# EAGLE schematic Ver_Full (EAGLE 9.6.2)
Contributed by Nordic Semiconductor Product Page here <http://infocenter.nordicsemi.com/index.jsp?topic=%2Fcom.nordic.infocenter.nrf52832.ps.v1.1%2Fref_circuitry.html> Disclaimer: For the most up to date reference layout see the infocenter at nordicsemi.com Description: Bluetooth Low Energy board

## Sheet 1 of 2
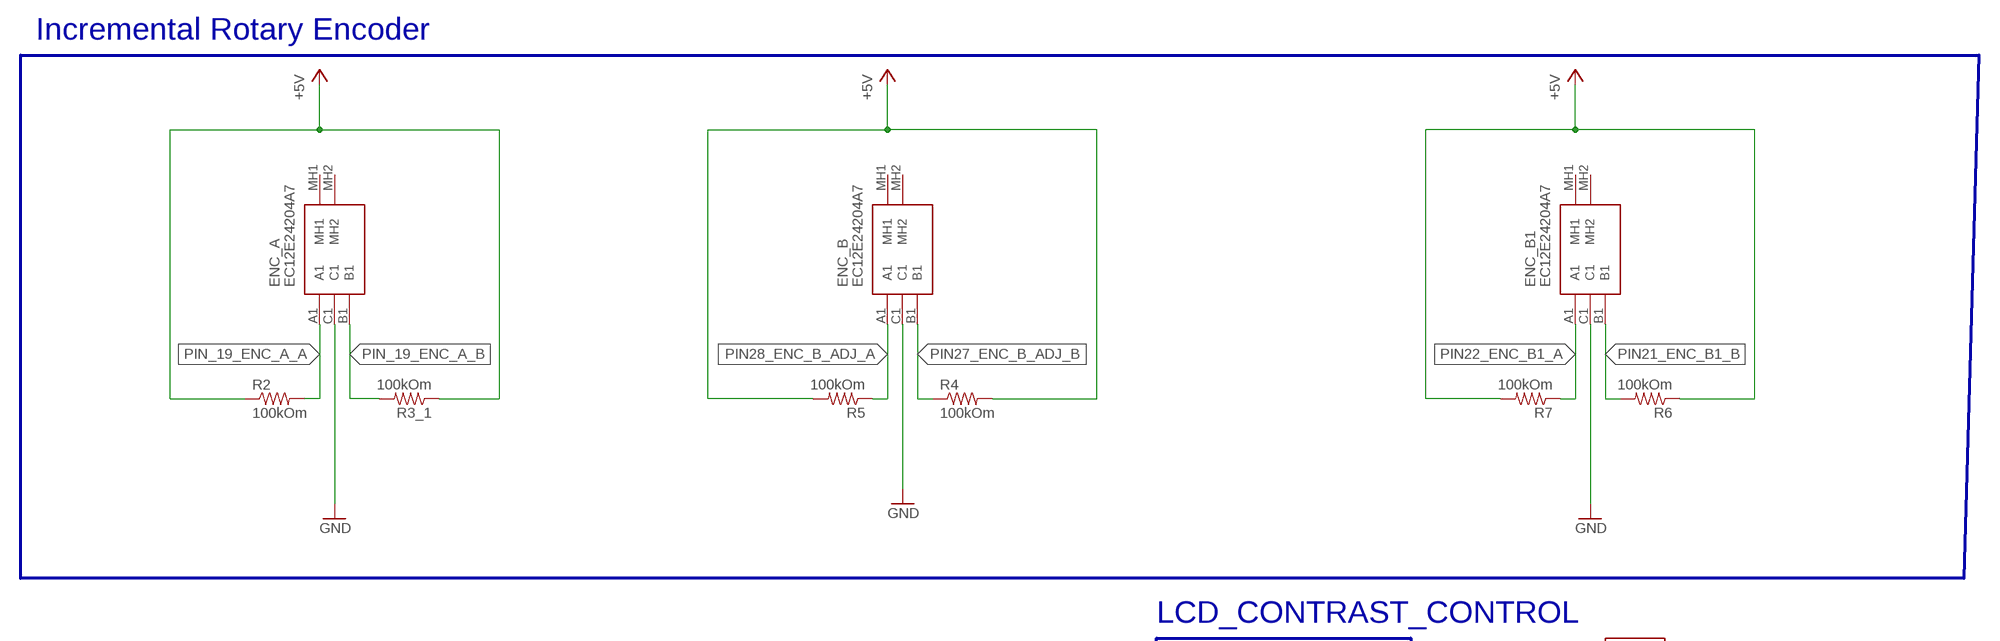
[diagram p0: schematic, sheet 1, part 1 of 3]
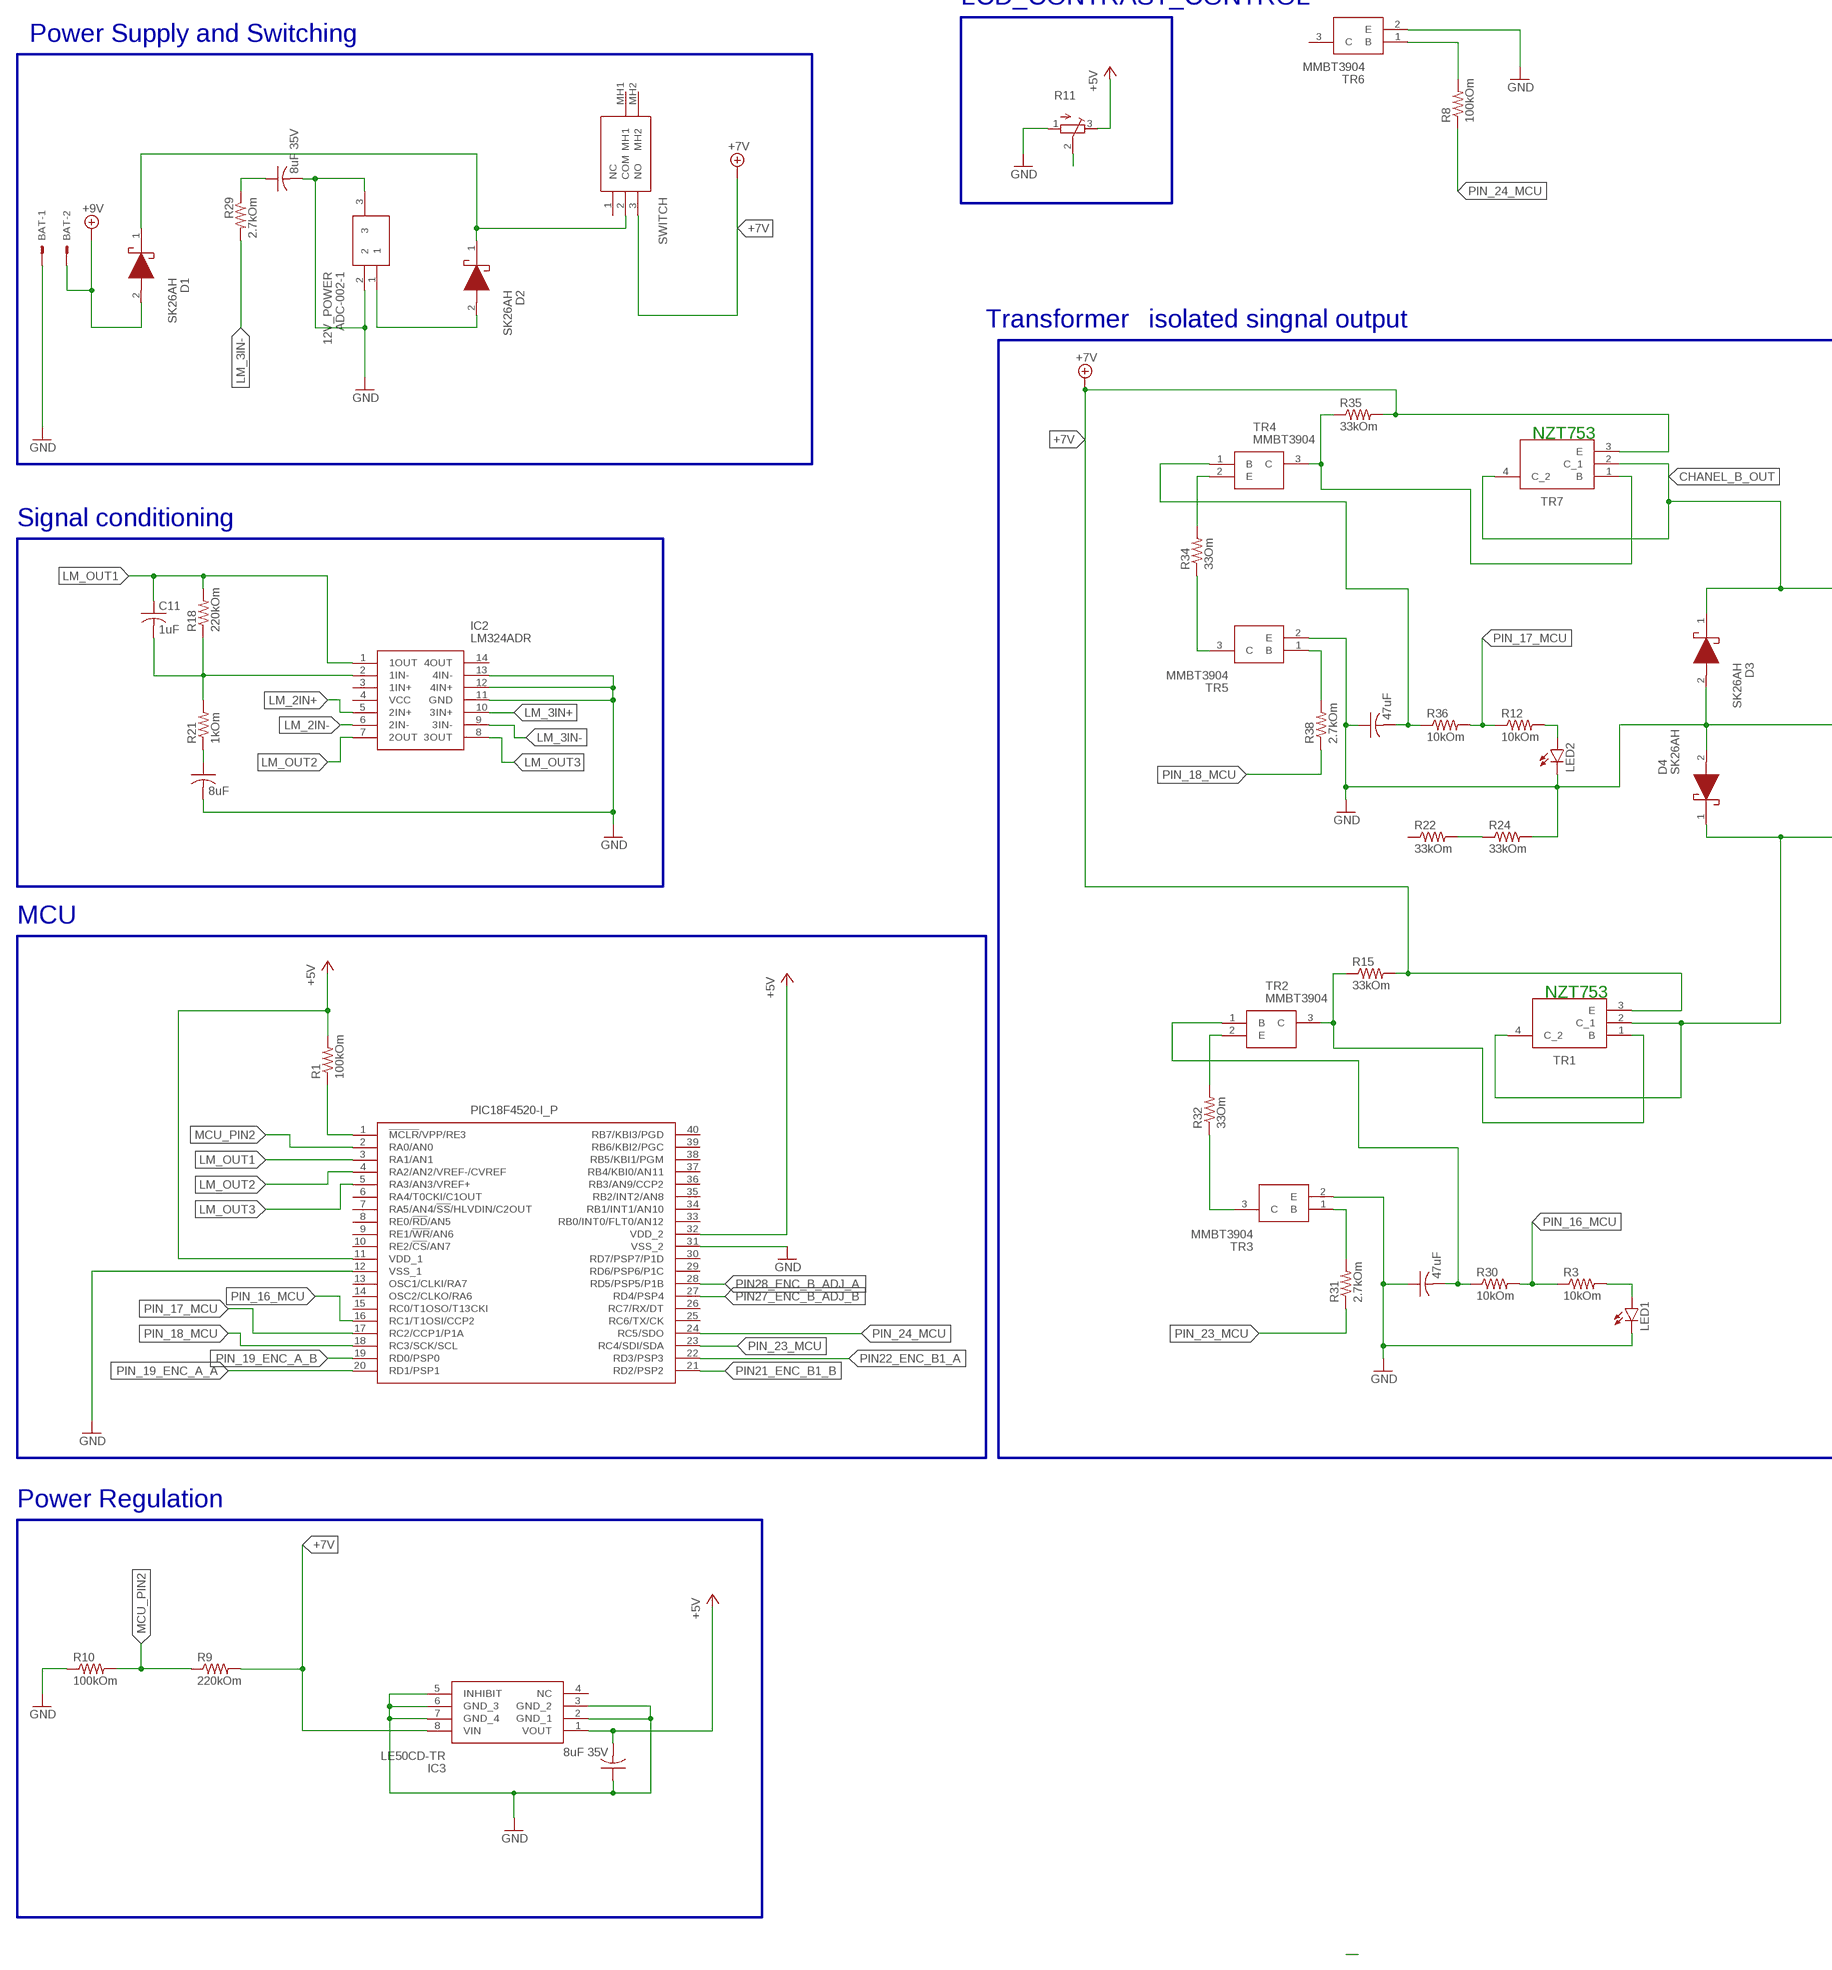
[diagram p1: schematic, sheet 1, part 2 of 3]
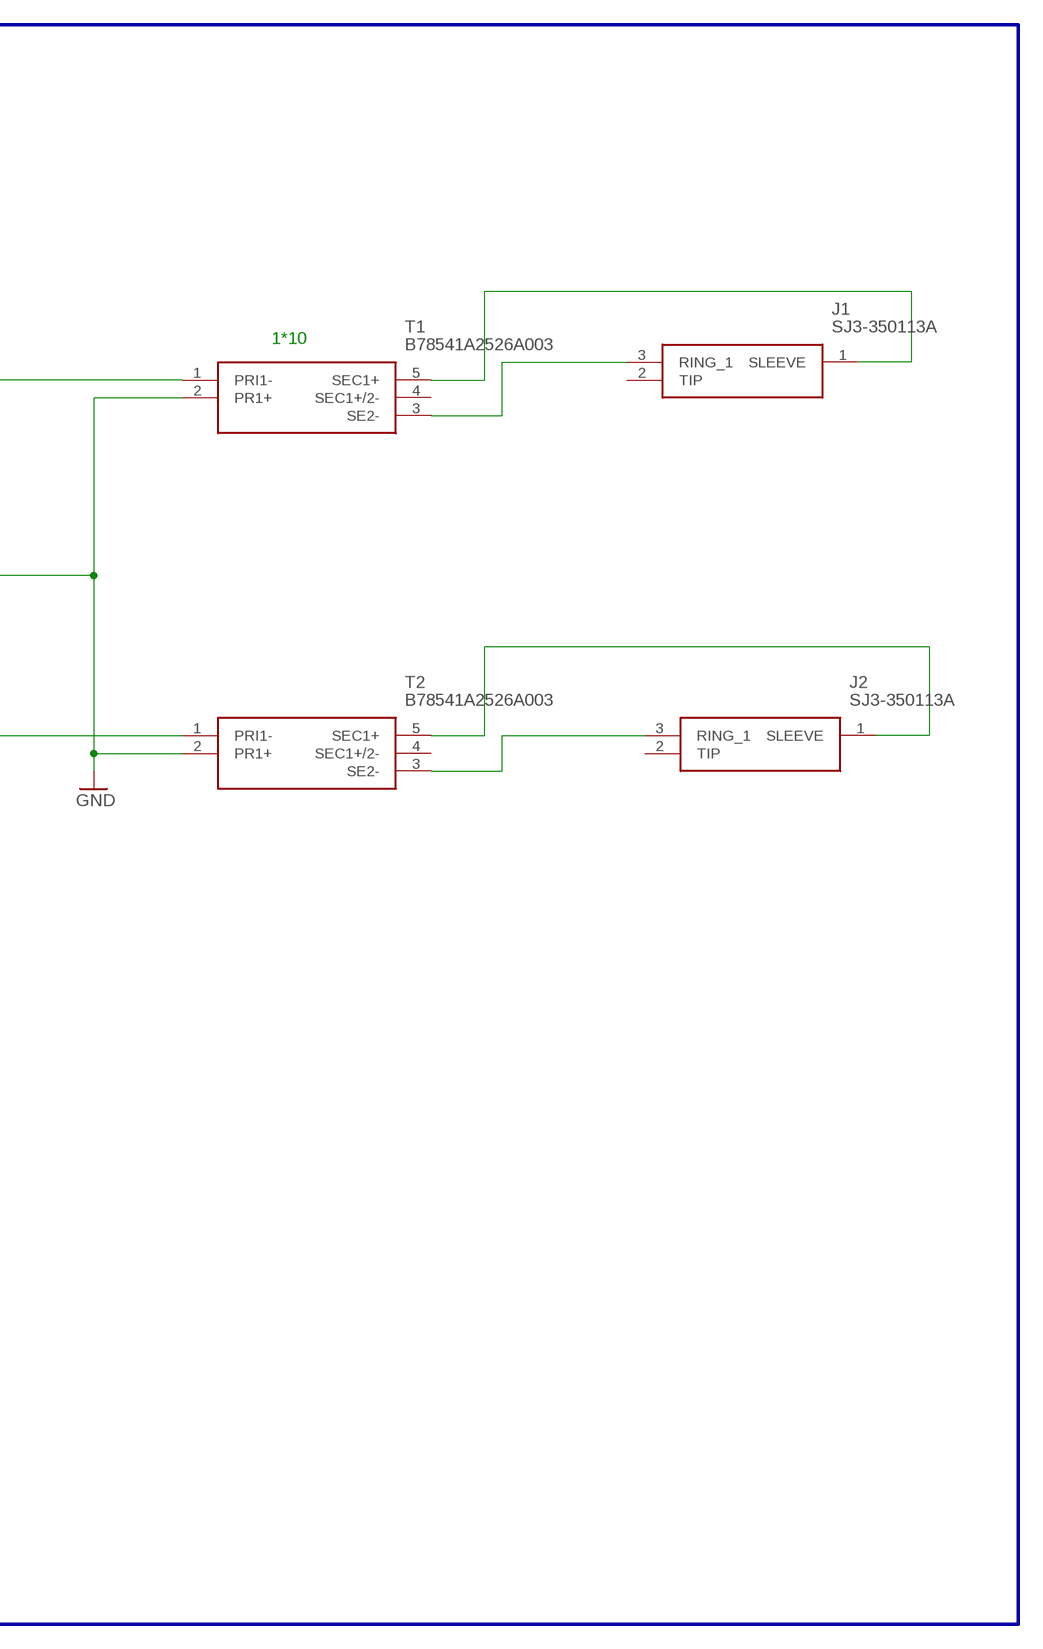
[diagram p2: schematic, sheet 1, part 3 of 3]

### Parts
12V_POWER  ADC-002-1  [ADC0021]
BAT  22-23-2021  [22-23-2021]
C2  8uF 35V  C-USC1608  [C1608]
C3_1  8uF 35V  C-USC1608  [C1608]
C6  8uF  C-USC1608  [C1608]
C11  1uF  C-USC0603  [C0603]
C14  47uF  C-USC1608  [C1608]
C16  47uF  C-USC1608  [C1608]
D1  SK26AH  [DIONM5126X250N]
D2  SK26AH  [DIONM5126X250N]
D3  SK26AH  [DIONM5126X250N]
D4  SK26AH  [DIONM5126X250N]
ENC_A  EC12E24204A7  [EC12E24204A7]
ENC_B  EC12E24204A7  [EC12E24204A7]
ENC_B1  EC12E24204A7  [EC12E24204A7]
IC1  PIC18F4520-I_P  [DIP1778W58P254L5175H635Q40N]
IC2  LM324ADR  [SOIC127P600X175-14N]
IC3  LE50CD-TR  [SOIC127P600X175-8N]
J1  SJ3-350113A  [SJ3350113A]
J2  SJ3-350113A  [SJ3350113A]
LED1  LAP4-BOTTOM  [P47F-BOTTOM]
LED2  LAP4-BOTTOM  [P47F-BOTTOM]
R1  100kOm  R-US_R0402  [R0402]
R2  100kOm  R-US_R0402  [R0402]
R3  10kOm  R-US_R0402  [R0402]
R3_1  100kOm  R-US_R0402  [R0402]
R4  100kOm  R-US_R0402  [R0402]
R5  100kOm  R-US_R0402  [R0402]
R6  100kOm  R-US_R0402  [R0402]
R7  100kOm  R-US_R0402  [R0402]
R8  100kOm  R-US_R0402  [R0402]
R9  220kOm  R-US_R0402  [R0402]
R10  100kOm  R-US_R0402  [R0402]
R11  R-TRIMM4G/J  [RTRIM4G/J]
R12  10kOm  R-US_R0402  [R0402]
R15  33kOm  R-US_R0402  [R0402]
R18  220kOm  R-US_R0402  [R0402]
R21  1kOm  R-US_R0402  [R0402]
R22  33kOm  R-US_R0402  [R0402]
R24  33kOm  R-US_R0402  [R0402]
R29  2.7kOm  R-US_R0402  [R0402]
R30  10kOm  R-US_R0402  [R0402]
R31  2.7kOm  R-US_R0402  [R0402]
R32  33Om  R-US_R0402  [R0402]
R34  33Om  R-US_R0402  [R0402]
R35  33kOm  R-US_R0402  [R0402]
R36  10kOm  R-US_R0402  [R0402]
R38  2.7kOm  R-US_R0402  [R0402]
S1  SWITCH  5MS1S102AM6QES  [5MS1S102AM6QES]
T1  B78541A2526A003  [B78541A2526A003]
T2  B78541A2526A003  [B78541A2526A003]
TR1  NSS60600MZ4T1G  [SOT230P700X175-4N]
TR2  MMBT3904  [SOT95P240X120-3N]
TR3  MMBT3904  [SOT95P240X120-3N]
TR4  MMBT3904  [SOT95P240X120-3N]
TR5  MMBT3904  [SOT95P240X120-3N]
TR6  MMBT3904  [SOT95P240X120-3N]
TR7  NSS60600MZ4T1G  [SOT230P700X175-4N]

### Nets
12V: 12V_POWER.1 D2.2(A)
+5V: C3_1.2 IC1.11(VDD_1) IC1.32(VDD_2) IC3.1(VOUT) R1.2 R2.1 R3_1.1 R4.2 R5.2 R6.1 R7.2 R11.3(E)
+7V: IC3.8(VIN) R9.2 R15.2 R35.2 S1.3(NO) TR1.3(E) TR7.3(E)
+9V: BAT.2 D1.2(A)
CHANEL_B_OUT: D3.1(K) T1.1(PRI1-) TR7.2(C_1) TR7.4(C_2)
GND: 12V_POWER.2 12V_POWER.3 BAT.1 C2.2 C3_1.1 C6.2 C14.1 C16.1 D3.2(A) D4.2(A) ENC_A.C1 ENC_B1.C1 ENC_B.C1 IC1.12(VSS_1) IC1.31(VSS_2) IC2.11(GND) IC2.12(4IN+) IC2.13(4IN-) IC3.2(GND_1) IC3.3(GND_2) IC3.5(INHIBIT) IC3.6(GND_3) IC3.7(GND_4) LED1.C LED2.C R10.1 R11.1(A) R24.2 T1.2(PR1+) T2.2(PR1+) TR3.2(E) TR5.2(E) TR6.2(E)
LM_2IN+: IC2.5(2IN+)
LM_2IN-: IC2.6(2IN-)
LM_3IN+: IC2.10(3IN+)
LM_3IN-: IC2.9(3IN-) R29.2
LM_OUT1: C11.1 IC1.3(RA1/AN1) IC2.1(1OUT) R18.2
LM_OUT2: IC1.4(RA2/AN2/VREF-/CVREF) IC2.7(2OUT)
LM_OUT3: IC1.5(RA3/AN3/VREF+) IC2.8(3OUT)
MCU_PIN2: IC1.2(RA0/AN0) R9.1 R10.2
N$1: IC1.1(!MCLR!/VPP/RE3) R1.1
N$2: C11.2 IC2.2(1IN-) R18.1 R21.2
N$4: C16.2 R36.1 TR4.1(B)
N$5: R34.2 TR4.2(E)
N$6: R38.2 TR5.1(B)
N$7: R34.1 TR5.3(C)
N$8: R35.1 TR4.3(C) TR7.1(B)
N$11: D1.1(K) D2.1(K) S1.2(COM)
N$12: C2.1 R29.1
N$13: C6.1 R21.1
N$14: J1.1(SLEEVE) T1.5(SEC1+)
N$15: C14.2 R30.1 TR2.1(B)
N$16: R32.2 TR2.2(E)
N$17: R32.1 TR3.3(C)
N$18: R31.2 TR3.1(B)
N$19: R15.1 TR1.1(B) TR2.3(C)
N$21: D4.1(K) T2.1(PRI1-) TR1.2(C_1) TR1.4(C_2)
N$22: J1.3(RING_1) T1.3(SE2-)
N$23: LED2.A R12.2
N$24: J2.3(RING_1) T2.3(SE2-)
N$25: LED1.A R3.2
N$26: J2.1(SLEEVE) T2.5(SEC1+)
N$27: R22.2 R24.1
N$28: R8.2 TR6.1(B)
N$29: R11.2(S)
PIN21_ENC_B1_B: ENC_B1.B1 IC1.21(RD2/PSP2) R6.2
PIN22_ENC_B1_A: ENC_B1.A1 IC1.22(RD3/PSP3) R7.1
PIN27_ENC_B_ADJ_B: ENC_B.B1 IC1.27(RD4/PSP4) R4.1
PIN28_ENC_B_ADJ_A: ENC_B.A1 IC1.28(RD5/PSP5/P1B) R5.1
PIN_16_MCU: IC1.16(RC1/T1OSI/CCP2) R3.1 R30.2
PIN_17_MCU: IC1.17(RC2/CCP1/P1A) R12.1 R36.2
PIN_18_MCU: IC1.18(RC3/SCK/SCL) R38.1
PIN_19_ENC_A_A: ENC_A.A1 IC1.20(RD1/PSP1) R2.2
PIN_19_ENC_A_B: ENC_A.B1 IC1.19(RD0/PSP0) R3_1.2
PIN_23_MCU: IC1.23(RC4/SDI/SDA) R31.1
PIN_24_MCU: IC1.24(RC5/SDO) R8.1
Unconnected: ENC_A.MH1 ENC_A.MH2 ENC_B1.MH1 ENC_B1.MH2 ENC_B.MH1 ENC_B.MH2 IC1.6(RA4/T0CKI/C1OUT) IC1.7(RA5/AN4/!SS!/HLVDIN/C2OUT) IC1.8(RE0/!RD!/AN5) IC1.9(RE1/!WR!/AN6) IC1.10(RE2/!CS!/AN7) IC1.13(OSC1/CLKI/RA7) IC1.14(OSC2/CLKO/RA6) IC1.15(RC0/T1OSO/T13CKI) IC1.25(RC6/TX/CK) IC1.26(RC7/RX/DT) IC1.29(RD6/PSP6/P1C) IC1.30(RD7/PSP7/P1D) IC1.33(RB0/INT0/FLT0/AN12) IC1.34(RB1/INT1/AN10) IC1.35(RB2/INT2/AN8) IC1.36(RB3/AN9/CCP2) IC1.37(RB4/KBI0/AN11) IC1.38(RB5/KBI1/PGM) IC1.39(RB6/KBI2/PGC) IC1.40(RB7/KBI3/PGD) IC2.3(1IN+) IC2.4(VCC) IC2.14(4OUT) IC3.4(NC) J1.2(TIP) J2.2(TIP) R22.1 S1.1(NC) S1.MH1 S1.MH2 T1.4(SEC1+/2-) T2.4(SEC1+/2-) TR6.3(C)

### Buses
B$1
B$2
B$3
B$4
B$5
B$6
B$7

### Notes on the sheet
- Incremental Rotary Encoder
- LCD_CONTRAST_CONTROL
- Power Supply and Switching
- Transformer‑isolated singnal output
- NZT753
- Signal conditioning
- 1*10
- MCU
- NZT753
- Power Regulation

## Sheet 2 of 2
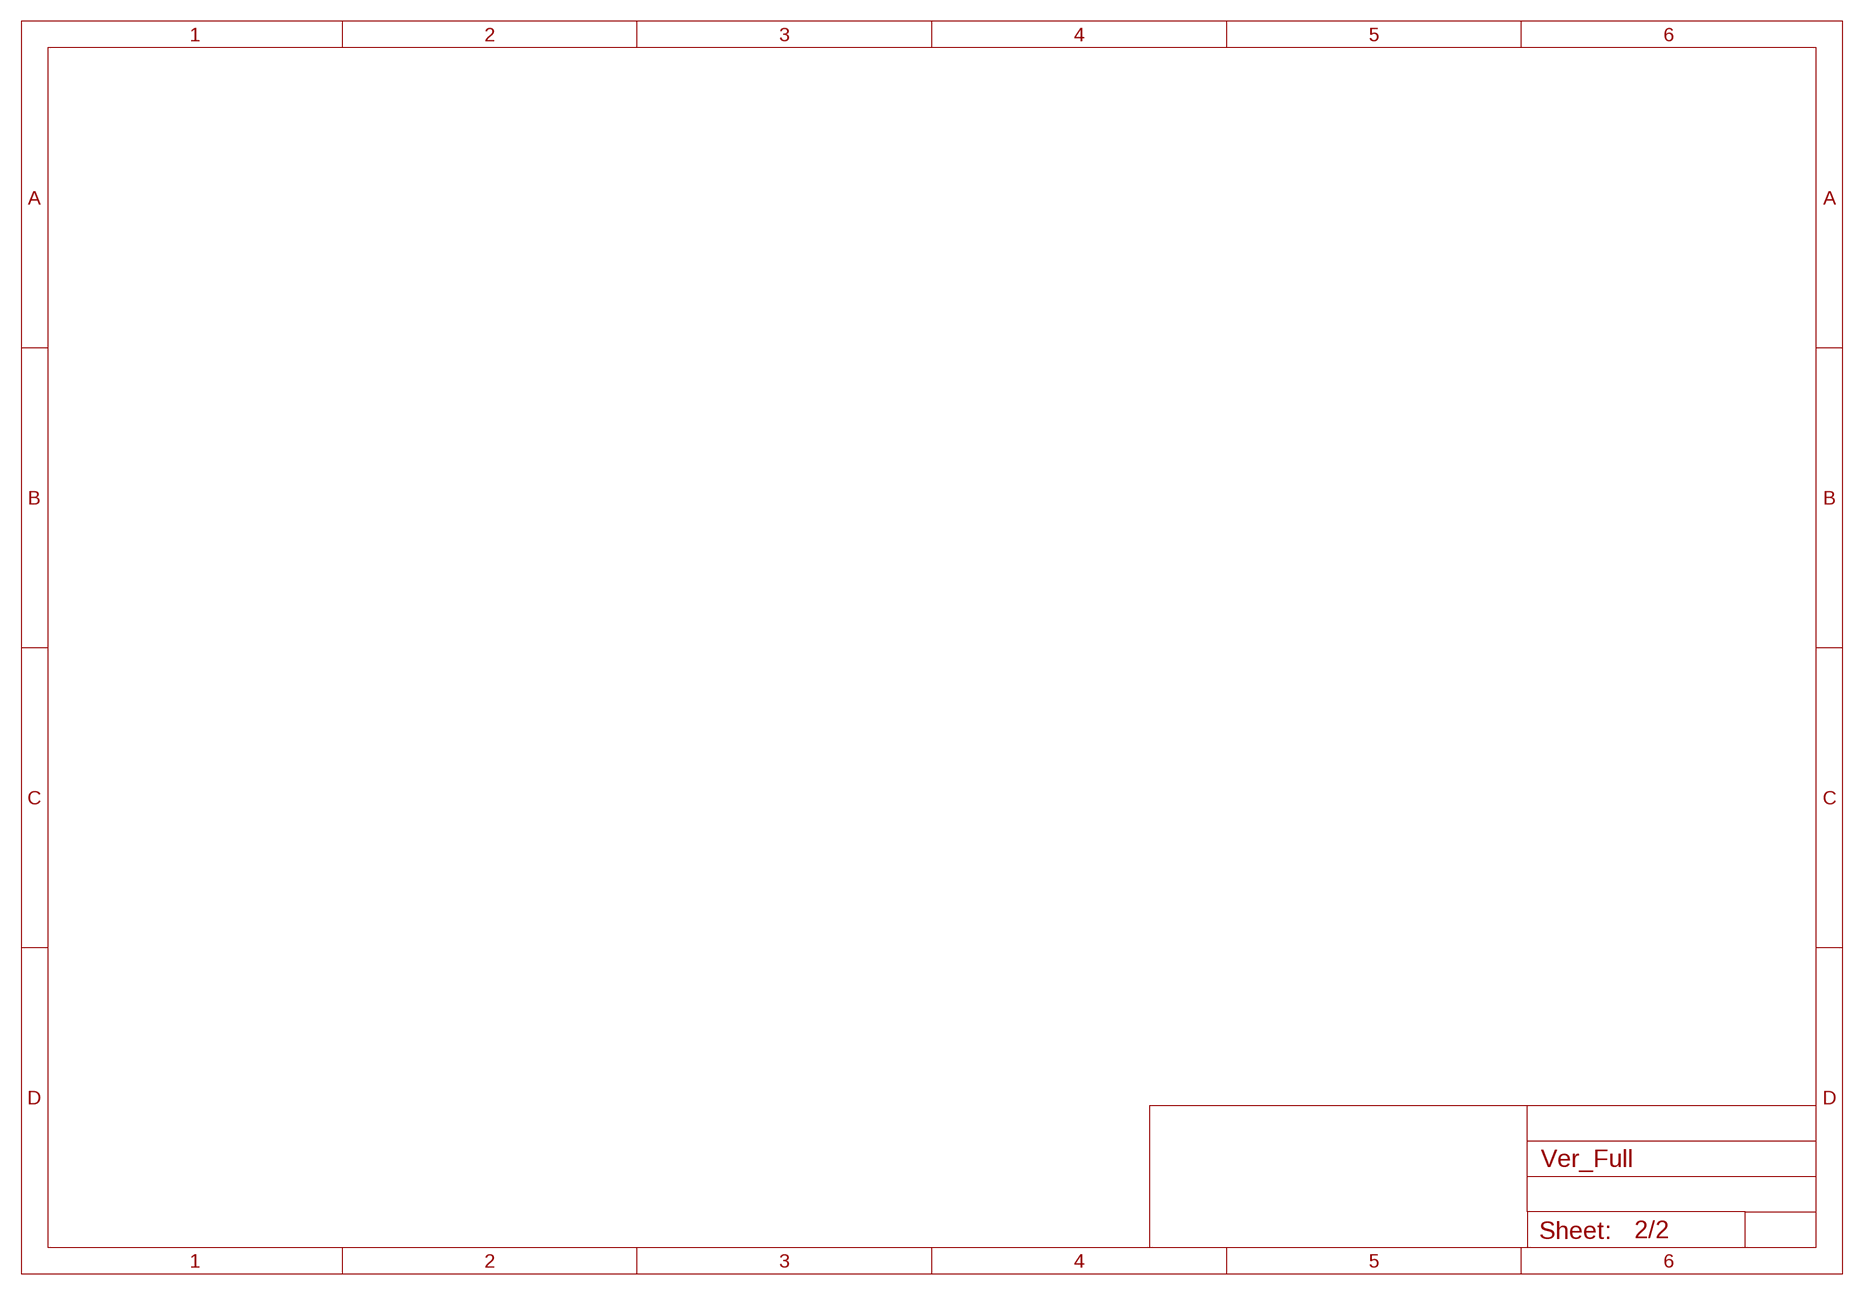
[diagram p3: schematic, sheet 2]

## Library data of the parts
12V_POWER = SamacSys_Parts:ADC-002-1: Power Barrel Connector Jack Through Hole, Right Angle Source: Datasheet <https://www.digikey.ph/en/products/detail/adam-tech/ADC-002-1/21710741?msockid=39f1ec84d77b6f4428b7f904d6676eed>; DESCRIPTION: Power Barrel Connector Jack Through Hole, Right Angle; HEIGHT: 11.3792mm; MANUFACTURER_NAME: Adam Tech; MANUFACTURER_PART_NUMBER: ADC-002-1; MOUSER_PART_NUMBER: 737-ADC-002-1; MOUSER_PRICE-STOCK: https://www.mouser.co.uk/ProductDetail/Adam-Tech/ADC-002-1?qs=TTVbHWoAP%2FQzK0nl%252BlYw5w%3D%3D
BAT = con-molex:22-23-2021: .100" (2.54mm) Center Header - 2 Pin; MF: MOLEX; MPN: 22-23-2021; OC_FARNELL: 1462926; OC_NEWARK: 25C3832
C2 C3_1 C6 C11 C14 C16 = rcl:C-US: CAPACITOR, American symbol; SPICEPREFIX: C
D1-D4 = SamacSys_Parts:SK26AH: Schottky Diodes & Rectifiers 2A, 60V, Schottky Rectifier Source: Datasheet <https://services.taiwansemi.com/storage/resources/datasheet/SK22AH SERIES_C2307.pdf>; DESCRIPTION: Schottky Diodes & Rectifiers 2A, 60V, Schottky Rectifier; HEIGHT: 2.5mm; MANUFACTURER_NAME: Taiwan Semiconductor; MANUFACTURER_PART_NUMBER: SK26AH; MOUSER_PART_NUMBER: 821-SK26AH; MOUSER_PRICE-STOCK: https://www.mouser.co.uk/ProductDetail/Taiwan-Semiconductor/SK26AH?qs=lc2O%252BfHJPVZtnjroFweAcw%3D%3D
ENC_A ENC_B ENC_B1 = SamacSys_Parts:EC12E24204A7: Encoders 5 Volts Through Hole Source: Datasheet; DESCRIPTION: Encoders 5 Volts Through Hole; HEIGHT: 17.5mm; MANUFACTURER_NAME: ALPS Electric; MANUFACTURER_PART_NUMBER: EC12E24204A7; MOUSER_PART_NUMBER: 688-EC12E24204A7; MOUSER_PRICE-STOCK: https://www.mouser.co.uk/ProductDetail/Alps-Alpine/EC12E24204A7?qs=6EGMNY9ZYDRQC31O9PLGdQ%3D%3D
IC1 = SamacSys_Parts:PIC18F4520-I_P: Micro,PIC,32K Fl,DIP40,PIC18F4520-I/P Microchip PIC18F4520-I/P, 8bit PIC Microcontroller, 40MHz, 32 kB, 256 B Flash, 40-Pin PDIP Source: Datasheet <https://datasheet.datasheetarchive.com/originals/distributors/Datasheets-DGA25/1725603.pdf>; DESCRIPTION: Micro,PIC,32K Fl,DIP40,PIC18F4520-I/P Microchip PIC18F4520-I/P, 8bit PIC Microcontroller, 40MHz, 32 kB, 256 B Flash, 40-Pin PDIP; HEIGHT: 6.35mm; MANUFACTURER_NAME: Microchip; MANUFACTURER_PART_NUMBER: PIC18F4520-I/P; MOUSER_PART_NUMBER: 579-PIC18F4520-I/P; MOUSER_PRICE-STOCK: https://www.mouser.co.uk/ProductDetail/Microchip-Technology/PIC18F4520-I-P?qs=sX%2FisSQq3c766Z6wYlOmBg%3D%3D
IC2 = SamacSys_Parts:LM324ADR: LM324ADR, Quad Operational Amplifier 1.2MHz 5 to 28V, 14-Pin SOIC Source: Datasheet <http://www.ti.com/lit/ds/symlink/lm324a.pdf>; DESCRIPTION: LM324ADR, Quad Operational Amplifier 1.2MHz 5 to 28V, 14-Pin SOIC; HEIGHT: 1.75mm; MANUFACTURER_NAME: Texas Instruments; MANUFACTURER_PART_NUMBER: LM324ADR; MOUSER_PART_NUMBER: 595-LM324ADR; MOUSER_PRICE-STOCK: https://www.mouser.co.uk/ProductDetail/Texas-Instruments/LM324ADR?qs=j01uVdFEFjGTgJsnyinRPw%3D%3D
IC3 = SamacSys_Parts:LE50CD-TR: LE50CD-TR, Low Dropout Voltage Regulator, 0.1A, 5 V +/-2%, 8-Pin SO Source: Datasheet <http://www.st.com/st-web-ui/static/active/en/resource/technical/document/datasheet/CD00000545.pdf>; DESCRIPTION: LE50CD-TR, Low Dropout Voltage Regulator, 0.1A, 5 V +/-2%, 8-Pin SO; HEIGHT: 1.75mm; MANUFACTURER_NAME: STMicroelectronics; MANUFACTURER_PART_NUMBER: LE50CD-TR; MOUSER_PART_NUMBER: 511-LE50CD-TR; MOUSER_PRICE-STOCK: https://www.mouser.co.uk/ProductDetail/STMicroelectronics/LE50CD-TR?qs=03sMZZnzz33VVYaNvjw4jw%3D%3D
J1 J2 = SamacSys_Parts:SJ3-350113A: 3.50mm (0.141", 1/8", Mini Plug) - Headphone Phone Jack Stereo (3 Conductor, TRS) Connector Solder Source: Datasheet <https://www.sameskydevices.com/product/resource/sj3-35011x.pdf>; DESCRIPTION: 3.50mm (0.141", 1/8", Mini Plug) - Headphone Phone Jack Stereo (3 Conductor, TRS) Connector Solder; HEIGHT: 5.8mm; MANUFACTURER_NAME: Same Sky; MANUFACTURER_PART_NUMBER: SJ3-350113A
LED1 LED2 = led:*P4: PointLED® Enhanced Thinfilm LED TOP & BOTTOM mount LS P47F, LR P47F, LA P47F, LY P47F, LT P4SG, LB P4SG, LW P4SG Source: http://catalog.osram-os.com .. LA_LR_LS_LY_P47F_Pb_free.pdf
R1-R3 R3_1 R4-R10 R12 R15 R18 R21 R22 R24 R29-R32 R34-R36 R38 = rcl:R-US_: RESISTOR, American symbol; SPICEPREFIX: R
R11 = rcl:R-TRIMM: Trimm resistor; SPICEMODEL: X; SPICEPREFIXL: POT
S1 = SamacSys_Parts:5MS1S102AM6QES: Slide Switches ON-ON SPDT Right Source: Datasheet; DESCRIPTION: Slide Switches ON-ON SPDT Right; HEIGHT: 6.6mm; MANUFACTURER_NAME: Dailywell; MANUFACTURER_PART_NUMBER: 5MS1S102AM6QES; MOUSER_PART_NUMBER: 118-5MS1S102AM6QES; MOUSER_PRICE-STOCK: https://www.mouser.co.uk/ProductDetail/Dailywell/5MS1S102AM6QES?qs=B6kkDfuK7%2FBHVJoQEkyphg%3D%3D
T1 T2 = SamacSys_Parts:B78541A2526A003: SMT gate-drive transformers , Ferrite core MnZn SMD gullwing pins Triple insulated wire class F (155 C)Plastic bobbin (UL94-V0) , 150 C , 2500 V Source: Datasheet <https://product.tdk.com/system/files/dam/doc/product/transformer/transformer/gate-drive/b78541a-ui7.pdf>; DESCRIPTION: SMT gate-drive transformers , Ferrite core MnZn SMD gullwing pins Triple insulated wire class F (155 C)Plastic bobbin (UL94-V0) , 150 C , 2500 V; HEIGHT: 9.7mm; MANUFACTURER_NAME: TDK; MANUFACTURER_PART_NUMBER: B78541A2526A003
TR1 TR7 = SamacSys_Parts:NSS60600MZ4T1G: Low Collector-Emitter Saturation Voltage; High DC Current Gain; High Current-Gain Bandwidth Product; Superior gain linearity; NSV Prefix for Automotive and Other Applications Requiring Unique Site and Control Change Requirements; AECQ101 Qualified and PPAP Capable; These Devices are PbFree, Halogen Free/BFR Free and are RoHS Compliant Source: Datasheet <https://www.onsemi.com/pub/Collateral/NSS60600MZ4-D.PDF>; DESCRIPTION: Low Collector-Emitter Saturation Voltage; High DC Current Gain; High Current-Gain Bandwidth Product; Superior gain linearity; NSV Prefix for Automotive and Other Applications Requiring Unique Site and Control Change Requirements; AECQ101 Qualified and PPAP Capable; These Devices are PbFree, Halogen Free/BFR Free and are RoHS Compliant; HEIGHT: 1.75mm; MANUFACTURER_NAME: onsemi; MANUFACTURER_PART_NUMBER: NSS60600MZ4T1G; MOUSER_PART_NUMBER: 863-NSS60600MZ4T1G; MOUSER_PRICE-STOCK: https://www.mouser.co.uk/ProductDetail/ON-Semiconductor/NSS60600MZ4T1G/?qs=Jh7l0IbPjiczEfdiWBQ42w%3D%3D
TR2-TR6 = SamacSys_Parts:MMBT3904: Trans GP BJT NPN 40V 0.2A Automotive 3-Pin SOT-23 Source: Datasheet <https://media.digikey.com/pdf/Data Sheets/ON Semiconductor PDFs/2N3904,MMBT3904,PZT3904.pdf>; DESCRIPTION: Trans GP BJT NPN 40V 0.2A Automotive 3-Pin SOT-23; HEIGHT: 1.2mm; MANUFACTURER_NAME: Diotec; MANUFACTURER_PART_NUMBER: MMBT3904; MOUSER_PART_NUMBER: 637-MMBT3904; MOUSER_PRICE-STOCK: https://www.mouser.co.uk/ProductDetail/Diotec-Semiconductor/MMBT3904?qs=OlC7AqGiEDkK1MwiyUU6mg%3D%3D